# EAGLE design Mergen Telemetri + Ateşleme (EAGLE 9.6.2)
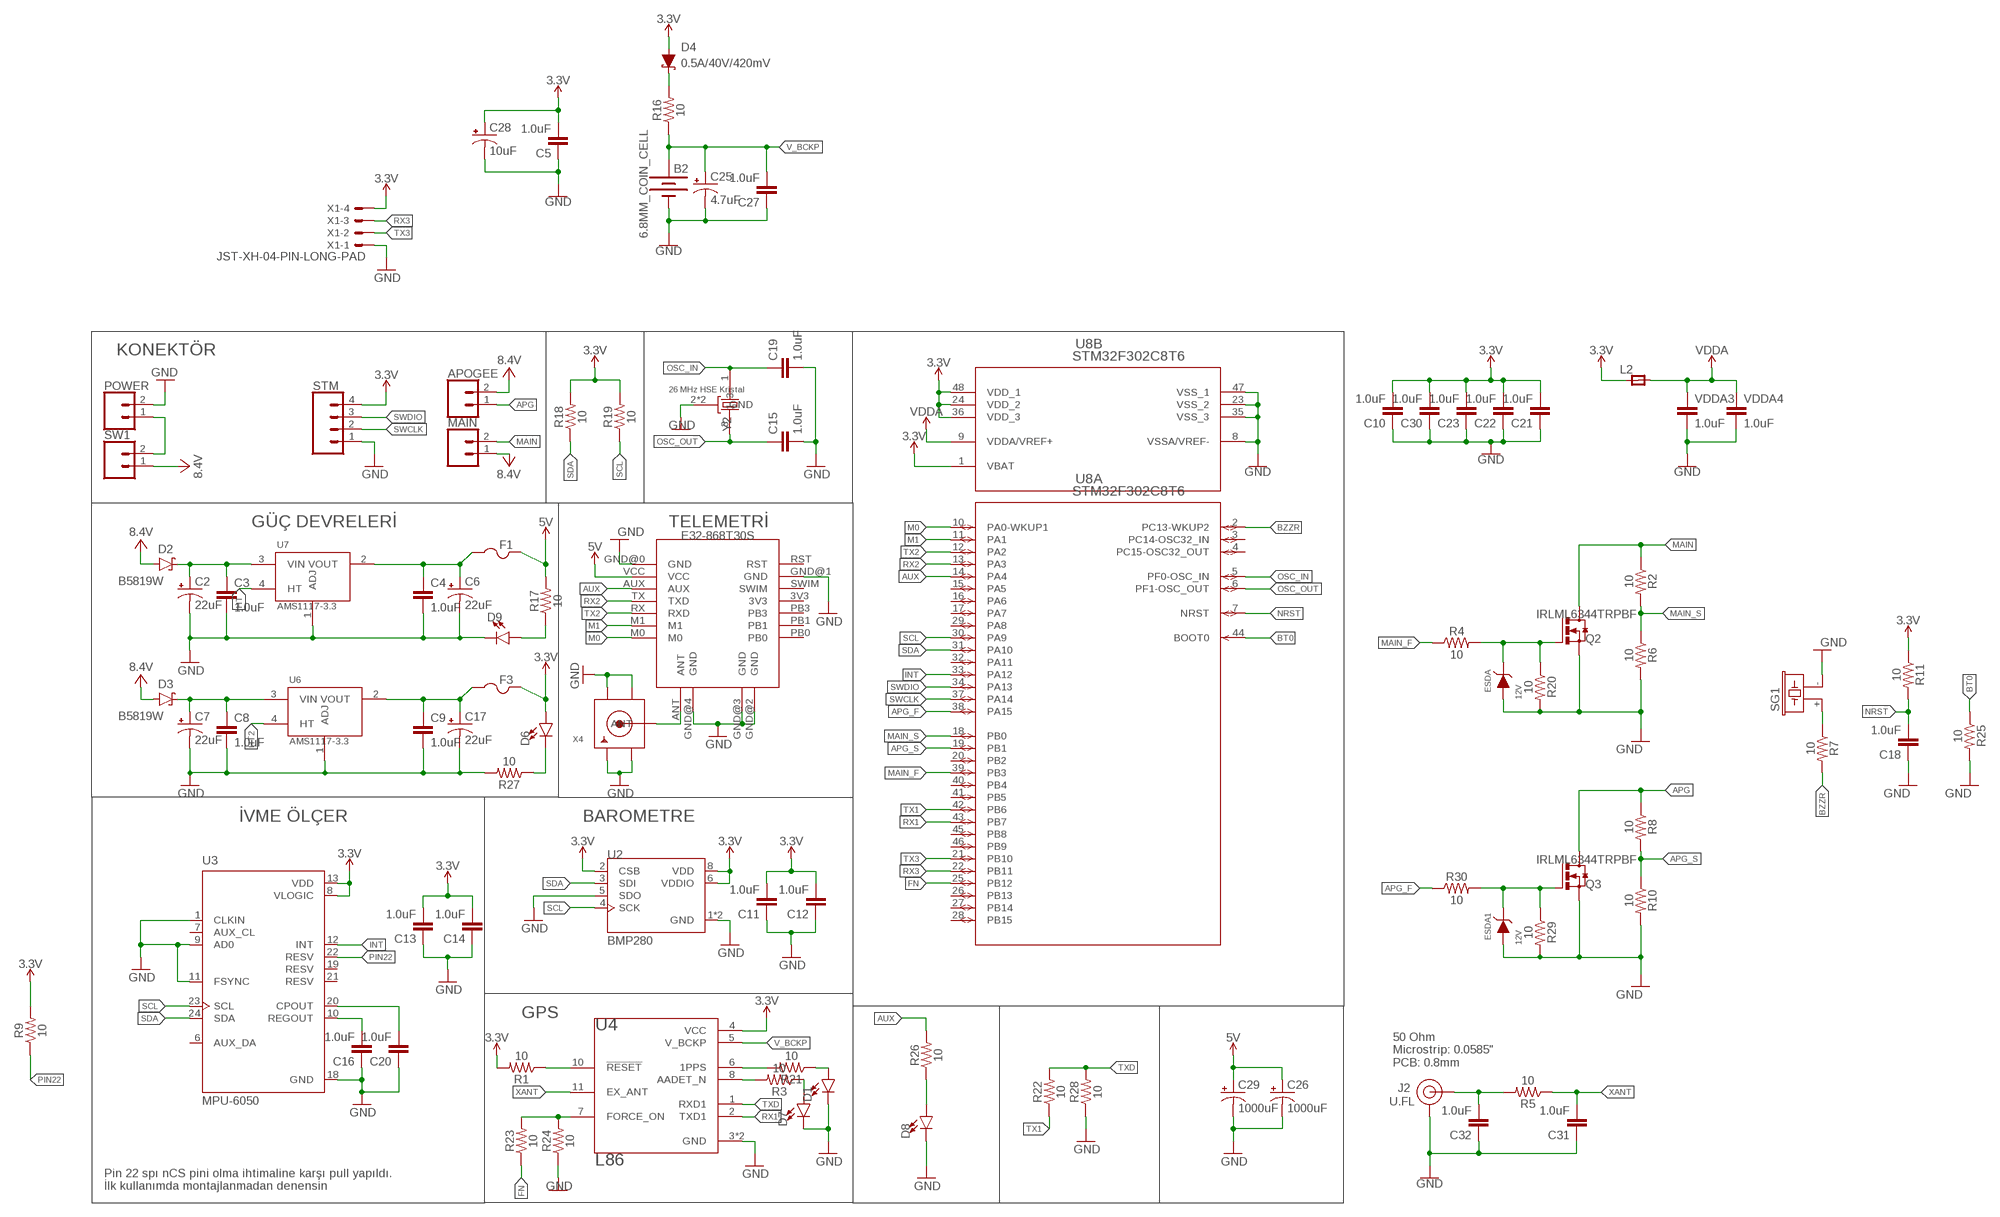
[diagram p0: schematic, sheet 1]

## Parts
APOGEE  CONN_023.5MM-NO_SILK  [SCREWTERMINAL-3.5MM-2-NS]
B2  6.8MM_COIN_CELL  BATTERY-6.8MM_SMD  [BATTCON-6.8MM]
C2  22uF  47UF-POLAR-EIA3528-10V-10%  [EIA3528]
C3  1.0uF  1.0UF-1206-50V-10%  [1206]
C4  1.0uF  1.0UF-1206-50V-10%  [1206]
C5  1.0uF  1.0UF-1206-50V-10%  [1206]
C6  22uF  47UF-POLAR-EIA3528-10V-10%  [EIA3528]
C7  22uF  47UF-POLAR-EIA3528-10V-10%  [EIA3528]
C8  1.0uF  1.0UF-1206-50V-10%  [1206]
C9  1.0uF  1.0UF-1206-50V-10%  [1206]
C10  1.0uF  1.0UF-1206-50V-10%  [1206]
C11  1.0uF  1.0UF-1206-50V-10%  [1206]
C12  1.0uF  1.0UF-1206-50V-10%  [1206]
C13  1.0uF  1.0UF-1206-50V-10%  [1206]
C14  1.0uF  1.0UF-1206-50V-10%  [1206]
C15  1.0uF  1.0UF-1206-50V-10%  [1206]
C16  1.0uF  1.0UF-1206-50V-10%  [1206]
C17  22uF  47UF-POLAR-EIA3528-10V-10%  [EIA3528]
C18  1.0uF  1.0UF-1206-50V-10%  [1206]
C19  1.0uF  1.0UF-1206-50V-10%  [1206]
C20  1.0uF  1.0UF-1206-50V-10%  [1206]
C21  1.0uF  1.0UF-1206-50V-10%  [1206]
C22  1.0uF  1.0UF-1206-50V-10%  [1206]
C23  1.0uF  1.0UF-1206-50V-10%  [1206]
C25  4.7uF  47UF-POLAR-EIA3528-10V-10%  [EIA3528]
C26  1000uF  CPOL-US150CLZ-1010  [150CLZ-1010]
C27  1.0uF  1.0UF-1206-50V-10%  [1206]
C28  10uF  47UF-POLAR-EIA3528-10V-10%  [EIA3528]
C29  1000uF  CPOL-US150CLZ-1010  [150CLZ-1010]
C30  1.0uF  1.0UF-1206-50V-10%  [1206]
C31  1.0uF  1.0UF-1206-50V-10%  [1206]
C32  1.0uF  1.0UF-1206-50V-10%  [1206]
D1  LED1206  [LED-1206]
D2  B5819W  SCHOTTKY_MBR0520LT1GDO-219  [SODFL3718X115]
D3  B5819W  SCHOTTKY_MBR0520LT1GDO-219  [SODFL3718X115]
D4  0.5A/40V/420mV  DIODE-SCHOTTKY-PMEG4005EJ  [SOD-323]
D6  LED1206  [LED-1206]
D7  LED1206  [LED-1206]
D8  LED1206  [LED-1206]
D9  LED1206  [LED-1206]
ESDA  12V  WE-TVSP_DO-214AC_400W_UNI_824500102  [WE-TVSP_DO-214AC_UNIDIRECTIONAL]
ESDA1  12V  WE-TVSP_DO-214AC_400W_UNI_824500102  [WE-TVSP_DO-214AC_UNIDIRECTIONAL]
F1  1A  PTCFUSE-1206  [R1206]
F3  0.75A  PTCFUSE-1206  [R1206]
J2  U.FL  U.FL2PIN  [U.FL]
L2  RC-MASTER-SMD_FB_1206MP  [RC-MASTER-SMD_L1206MP]
MAIN  CONN_023.5MM-NO_SILK  [SCREWTERMINAL-3.5MM-2-NS]
POWER  CONN_023.5MM-NO_SILK  [SCREWTERMINAL-3.5MM-2-NS]
Q2  IRLML6344TRPBF  [SOT23]
Q3  IRLML6344TRPBF  [SOT23]
R1  10  10OHM-1206-1/4W-1%  [1206]
R2  10  10OHM-1206-1/4W-1%  [1206]
R3  10  10OHM-1206-1/4W-1%  [1206]
R4  10  10OHM-1206-1/4W-1%  [1206]
R5  10  10OHM-1206-1/4W-1%  [1206]
R6  10  10OHM-1206-1/4W-1%  [1206]
R7  10  10OHM-1206-1/4W-1%  [1206]
R8  10  10OHM-1206-1/4W-1%  [1206]
R9  10  10OHM-1206-1/4W-1%  [1206]
R10  10  10OHM-1206-1/4W-1%  [1206]
R11  10  10OHM-1206-1/4W-1%  [1206]
R16  10  10OHM-1206-1/4W-1%  [1206]
R17  10  10OHM-1206-1/4W-1%  [1206]
R18  10  10OHM-1206-1/4W-1%  [1206]
R19  10  10OHM-1206-1/4W-1%  [1206]
R20  10  10OHM-1206-1/4W-1%  [1206]
R21  10  10OHM-1206-1/4W-1%  [1206]
R22  10  10OHM-1206-1/4W-1%  [1206]
R23  10  10OHM-1206-1/4W-1%  [1206]
R24  10  10OHM-1206-1/4W-1%  [1206]
R25  10  10OHM-1206-1/4W-1%  [1206]
R26  10  10OHM-1206-1/4W-1%  [1206]
R27  10  10OHM-1206-1/4W-1%  [1206]
R28  10  10OHM-1206-1/4W-1%  [1206]
R29  10  10OHM-1206-1/4W-1%  [1206]
R30  10  10OHM-1206-1/4W-1%  [1206]
SG1  F/CM12P  [F/CM12P]
STM  CONN_04  [1X04]
SW1  CONN_023.5MM-NO_SILK  [SCREWTERMINAL-3.5MM-2-NS]
U2  BMP280  [XDCR_BMP280]
U3  MPU-6050  [QFN50P400X400X95-24N]
U4  L86  [XCVR_L86]
U5  E32-868T30S  [E32-868T30S]
U6  AMS1117-3.3  [SOT229P700X180-4N]
U7  AMS1117-3.3  [SOT229P700X180-4N]
U8  STM32F302C8T6  [LQFP48-7X7MM]
VDDA3  1.0uF  1.0UF-1206-50V-10%  [1206]
VDDA4  1.0uF  1.0UF-1206-50V-10%  [1206]
X1  JST-XH-04-PIN-LONG-PAD  [JST-XH-04-PACKAGE-LONG-PAD]
X4  SMACONNECTOR  [SMA90_DIP]
Y2  ABM3B-26.000MHZ-10-1-U-T  [OSCCC500X320X110-4N]

## Nets
3.3V: C5.2 C10.2 C11.2 C12.2 C13.2 C14.2 C21.2 C22.2 C23.2 C28.A(+) C30.2 D4.A D6.A F3.2 L2.1 R1.2 R9.2 R11.1 R18.2 R19.2 STM.4 U2.2(CSB) U2.6(VDDIO) U2.8(VDD) U3.8(VLOGIC) U3.13(VDD) U4.4(VCC) U8.1(B:VBAT) U8.24(B:VDD_2) U8.36(B:VDD_3) U8.48(B:VDD_1) X1.4
5V: C26.+ C29.+ F1.2 R17.2 U5.VCC
APG: APOGEE.1 Q3.3(D) R8.1
APG_F: R30.1 U8.38(A:PA15)
APG_S: R8.2 R10.1 U8.19(A:PB1)
AUX: R26.2 U5.AUX U8.14(A:PA4)
BT0: R25.1 U8.44(A:BOOT0)
BZZR: R7.2 U8.2(A:PC13-WKUP2)
FN: R23.1 U8.25(A:PB12)
GND: B2.- C2.C(-) C3.2 C4.2 C5.1 C6.C(-) C7.C(-) C8.2 C9.2 C10.1 C11.1 C12.1 C13.1 C14.1 C15.2 C16.1 C17.C(-) C18.1 C19.2 C20.1 C21.1 C22.1 C23.1 C25.C(-) C26.- C27.1 C28.C(-) C29.- C30.1 C31.1 C32.1 D1.C D7.C D8.C D9.C ESDA1.2(A) ESDA.2(A) J2.1(GND) J2.2(GND) POWER.2 Q2.2(S) Q3.2(S) R6.2 R10.2 R20.2 R24.1 R25.2 R27.2 R28.1 R29.2 SG1.- STM.1 U2.1(GND) U2.5(SDO) U2.7(GND) U3.1(CLKIN) U3.9(AD0) U3.11(FSYNC) U3.18(GND) U4.3(GND) U4.12(GND) U5.GND@0(GND) U5.GND@1(GND) U5.GND@2(GND) U5.GND@3(GND) U5.GND@4(GND) U6.1(ADJ) U7.1(ADJ) U8.8(B:VSSA/VREF-) U8.23(B:VSS_2) U8.35(B:VSS_3) U8.47(B:VSS_1) VDDA3.2 VDDA4.2 X1.1 X4.GND1 X4.GND2 X4.GND3 X4.GND4 Y2.2(GND) Y2.4(GND)
HT: U7.4(HT)
HT2: U6.4(HT)
INT: U3.12(INT) U8.33(A:PA12)
M0: U5.M0 U8.10(A:PA0-WKUP1)
M1: U5.M1 U8.11(A:PA1)
MAIN: MAIN.2 Q2.3(D) R2.1
MAIN_F: R4.1 U8.39(A:PB3)
MAIN_S: R2.2 R6.1 U8.18(A:PB0)
N$1: C2.A(+) C3.1 D2.1(C) U7.3(VIN)
N$2: C7.A(+) C8.1 D3.1(C) U6.3(VIN)
N$3: R1.1 U4.10(!RESET)
N$4: C4.1 C6.A(+) F1.1 U7.2(VOUT)
N$5: C9.1 C17.A(+) F3.1 U6.2(VOUT)
N$6: ESDA1.1(C) Q3.1(G) R29.1 R30.2
N$7: U5.ANT X4.ANTENNA(ANT)
N$8: R7.1 SG1.+
N$9: POWER.1 SW1.2
N$10: R21.2 U4.6(1PPS)
N$11: D1.A R21.1
N$12: D4.C R16.2
N$13: ESDA.1(C) Q2.1(G) R4.2 R20.1
N$14: D9.A R17.1
N$15: D6.C R27.1
N$16: R3.2 U4.8(AADET_N)
N$17: D7.A R3.1
N$18: C16.2 U3.10(REGOUT)
N$19: C32.2 J2.FEED(SIGNAL) R5.2
N$20: R23.2 R24.2 U4.7(FORCE_ON)
N$21: D8.A R26.1
N$22: C20.2 U3.20(CPOUT)
NRST: C18.2 R11.2 U8.7(A:NRST)
OSC_IN: C19.1 U8.5(A:PF0-OSC_IN) Y2.1
OSC_OUT: C15.1 U8.6(A:PF1-OSC_OUT) Y2.3
PIN22: R9.1 U3.22(RESV)
RX1: U4.2(TXD1) U8.43(A:PB7)
RX2: U5.TX(TXD) U8.13(A:PA3)
RX3: U8.22(A:PB11) X1.3
SCL: R19.1 U2.4(SCK) U3.23(SCL) U8.30(A:PA9)
SDA: R18.1 U2.3(SDI) U3.24(SDA) U8.31(A:PA10)
SWCLK: STM.2 U8.37(A:PA14)
SWDIO: STM.3 U8.34(A:PA13)
TX1: R22.1 U8.42(A:PB6)
TX2: U5.RX(RXD) U8.12(A:PA2)
TX3: U8.21(A:PB10) X1.2
TXD: R22.2 R28.2 U4.1(RXD1)
V_BCKP: B2.+ C25.A(+) C27.2 R16.1 U4.5(V_BCKP)
VCC: APOGEE.2 D2.2(A) D3.2(A) MAIN.1 SW1.1 ; supply symbol labelled 8.4V
VDDA: L2.2 U8.9(B:VDDA/VREF+) VDDA3.1 VDDA4.1
XANT: C31.2 R5.1 U4.11(EX_ANT)
Unconnected: U3.6(AUX_DA) U3.7(AUX_CL) U3.19(RESV) U3.21(RESV) U5.3V3 U5.PB0 U5.PB1 U5.PB3 U5.RST U5.SWIM U8.3(A:PC14-OSC32_IN) U8.4(A:PC15-OSC32_OUT) U8.15(A:PA5) U8.16(A:PA6) U8.17(A:PA7) U8.20(A:PB2) U8.26(A:PB13) U8.27(A:PB14) U8.28(A:PB15) U8.29(A:PA8) U8.32(A:PA11) U8.40(A:PB4) U8.41(A:PB5) U8.45(A:PB8) U8.46(A:PB9)

## Notes on the sheet
- KONEKTÖR
- 26 MHz HSE Kristal
- GÜÇ DEVRELERİ | TELEMETRİ
- İVME ÖLÇER | BAROMETRE
- GPS
- 50 Ohm 
  Microstrip: 0.0585"
  PCB: 0.8mm
- Pin 22 spı nCS pini olma ihtimaline karşı pull yapıldı. 
  İlk kullanımda montajlanmadan denensin

## Library data of the parts
APOGEE MAIN POWER SW1 = SparkFun-Connectors:CONN_02: Multi connection point. Often used as Generic Header-pin footprint for 0.1 inch spaced/style header connections On any of the 0.1 inch spaced packages, you can populate with these: Break Away Headers - Straight <https://www.sparkfun.com/products/116> (PRT-00116) Break Away Male Headers - Right Angle <https://www.sparkfun.com/products/553> (PRT-00553) Female Headers <https://www.sparkfun.com/products/115> (PRT-00115) Break Away Headers - Machine Pin <https://www.sparkfun.com/products/117> (PRT-00117) Break Away Female Headers - Swiss Machine Pin <https://www.sparkfun.com/products/743> (PRT-00743) For SCREWTERMINALS and SPRING TERMINALS visit here: Screw Terimnals on SparkFun.com <https://www.sparkfun.com/search/results?term=Screw+Terminals> (5mm/3.5mm/2.54mm spacing) This device is also useful as a general connection point to wire up your design to another part of your project. Our various solder wires solder well into these plated through hole pads. Hook-Up Wire - Assortment (Stranded, 22 AWG) <https://www.sparkfun.com/products/11375> (PRT-11375) Hook-Up Wire - Assortment (Solid Core, 22 AWG) <https://www.sparkfun.com/products/11367> (PRT-11367) View the entire wire category on our website here <https://www.sparkfun.com/categories/141> Special notes: Molex polarized connector foot print use with: PRT-08233 with associated crimp pins and housings. 2.54_SCREWTERM for use with PRT-10571. 3.5mm Screw Terminal footprints for PRT-08084 5mm Screw Terminal footprints for use with PRT-08432; PROD_ID: CONN-08399
B2 = SparkFun-Batteries:BATTERY: Battery - Single Cell A variety of battery chemistries, sizes, and footprints. Device List: 20MM_PTH - Coin Cell Battery Holder - 20mm (PTH) <https://www.sparkfun.com/products/783> 6.8MM_PTH - Coin Cell Battery Holder - 6.8MM(SMD) <https://www.digikey.com/product-detail/en/seiko-instruments/MS621FE-FL11E/728-1057-ND/1889208?WT.srch=1&gclid=CNOQ5a6LzdQCFZS2wAodXCkE0g> 12MM_SMD - Coin Cell Battery Holder - 12mm (SMD) <https://www.sparkfun.com/products/10592> 12MM_PTH - Coin Cell Battery Holder - 12mm (PTH) <https://www.sparkfun.com/products/7948> 20MM_SMD - 20mm Coin Cell Battery Holder (SMD) (2 legs) Used on the Big Time Watch Kit <https://www.sparkfun.com/products/11734> 20MM_SMD_4LEGS - Coin Cell Battery Holder - 20mm (SMD) <https://www.sparkfun.com/products/11892> 20MM_SMD_4LEGS_OVERPASTE - Coin Cell Battery Holder - 20mm (SMD) <https://www.sparkfun.com/products/11892> (Over-paste on the legs) 24.5MM_PTH - Coin Cell Battery Holder - 24.5mm (PTH) <https://www.sparkfun.com/products/8863> 9V - 9V Battery Holder - PC Mount Used on the SparkFun SparkPunk Sound Kit <https://www.sparkfun.com/products/11177> and SparkFun SparkPunk Sequencer Kit <https://www.sparkfun.com/products/12707> 18650 - Battery Holder - 18650 (PTH) <https://www.sparkfun.com/products/13113> AA - Battery Holder - 1xAA (PTH) <https://www.sparkfun.com/products/7949> AAA - Battery Holder - 1xAAA (PTH) <https://www.sparkfun.com/products/12718> AA_KIT - Battery Holder - 1xAA (PTH) <https://www.sparkfun.com/products/7949> Special kit package - pads only have exposed copper on one side of the board. AAA_KIT - Battery Holder - 1xAAA (PTH) <https://www.sparkfun.com/products/12718> Special kit package - pads only have exposed copper on one side of the board.; PROD_ID: BATT-13734
C2 C6 C7 C17 C25 C28 = SparkFun-Capacitors:47UF-POLAR: 47µF polarized capacitors A capacitor is a passive two-terminal electrical component used to store electrical energy temporarily in an electric field.; PROD_ID: CAP-08310; VALUE: 47uF
C3-C5 C8-C16 C18-C23 C27 C30-C32 VDDA3 VDDA4 = SparkFun-Capacitors:1.0UF: 1µF ceramic capacitors A capacitor is a passive two-terminal electrical component used to store electrical energy temporarily in an electric field.; PROD_ID: CAP-09822
C26 C29 = adafruit:CPOL-US: POLARIZED CAPACITOR, American symbol
D1 D6-D9 = SparkFun-LED:LED: LED (Generic) Standard schematic elements and footprints for 5mm, 3mm, 1206, and 0603 sized LEDs. Generic LEDs with no color specified.
D2 D3 = Diode:SCHOTTKY_: Schottky Diode - Popular parts; CATEGORY: Diode; DESCRIPTION: DIODE SCHOTTKY 20V 500MA SOD123; MANUFACTURER: ON Semiconductor; MPN: MBR0520LT1G; SUB-CATEGORY: Schottky; VALUE: MBR0520LT1G
D4 = SparkFun-DiscreteSemi:DIODE-SCHOTTKY: Schottky diode A Schottky diode is a semiconductor diode which has a low forward voltage drop and a very fast switching action.; PROD_ID: DIO-10955
ESDA ESDA1 = Wurth_EMC Components_WE-TVSP:WE-TVSP_DO-214AC_400W_UNI: WE-TVSP Power TVS Diode Characteristics Low Profile Package Glass passivated Juction Excellent clamping capability Fast response time MSL Level 1, per J-STD-020 Classification of the plastic case: UL 94 V-0 Safety certification UL 497B, E478010 Identical design: - DO-214AC = SMAJ - DO-214AA = SMBJ - DO-214AB = SMCJ/SMDJ Applications Ideal to protect the I/O Interfaces, Bus Voltage and other circuits of sensetive electronic equipment against voltage transiensts <https://www.we-online.com/catalog/media/o55793v209%20WE-TVSP_600W-3000W_D0214AA_4C.jpg> Details see: https://www.we-online.com/catalog/en/WE-TVSP/ Updated by Ella Wu 2020-07-20 2020 (C) Würth Elektronik; DATASHEET-URL: https://www.we-online.com/catalog/datasheet/824500102.pdf; IPEAK: 2.5A; MOUNT: SMT; PART-NUMBER: 824500102; PDISS: 400W; VALUE: 100V; VBR: 117V; VCLAMP: 162V
F1 F3 = adafruit:PTCFUSE: PTC fuses, resettable thermistors
J2 = SparkFun-Connectors:U.FL2PIN: SMD Antenna Connector - U.FL 2mm height, 3.0mm x 3.0mm receptacle size. SparkFun Products: SparkFun WiFi Shield - ESP8266 <https://www.sparkfun.com/products/13287> SparkFun ESP8266 Thing <https://www.sparkfun.com/products/13231> SparkFun MiniGen - Pro Mini Signal Generator Shield <https://www.sparkfun.com/products/11420>; PROD_ID: CONN-09193; SF_ID: WRL-09144
L2 = 52101-101-REV-A_v16:RC-MASTER-SMD_FB_: FERRITE BEAD
Q2 Q3 = IRLML6344TRPBF (1):IRLML6344TRPBF: Transistor NMOS 30V 6.3A, 29mOhm@4.5V; AVAILABILITY: Unavailable; DESCRIPTION: RoHS Compliant | Low RDS(on) | Industry-Standard Pinout | Compatible with Existing Surface Mount Techniques | Qualified MSL1 | SOT-23 Footprint; MF: Infineon; MP: IRLML6344TRPBF; PACKAGE: SOT-23-3 International Rectifier; PRICE: None
R1-R11 R16-R30 = SparkFun-Resistors:10OHM: 10Ω resistor A resistor is a passive two-terminal electrical component that implements electrical resistance as a circuit element. Resistors act to reduce current flow, and, at the same time, act to lower voltage levels within circuits. - Wikipedia; PROD_ID: RES-08705
SG1 = buzzer:F/CM12P: BUZZER Source: Buerklin; OC_FARNELL: unknown; OC_NEWARK: unknown
STM = SparkFun-Connectors:CONN_04: Multi connection point. Often used as Generic Header-pin footprint for 0.1 inch spaced/style header connections On any of the 0.1 inch spaced packages, you can populate with these: Break Away Headers - Straight <https://www.sparkfun.com/products/116> (PRT-00116) Break Away Male Headers - Right Angle <https://www.sparkfun.com/products/553> (PRT-00553) Female Headers <https://www.sparkfun.com/products/115> (PRT-00115) Break Away Headers - Machine Pin <https://www.sparkfun.com/products/117> (PRT-00117) Break Away Female Headers - Swiss Machine Pin <https://www.sparkfun.com/products/743> (PRT-00743) For SCREWTERMINALS and SPRING TERMINALS visit here: Screw Terimnals on SparkFun.com <https://www.sparkfun.com/search/results?term=Screw+Terminals> (5mm/3.5mm/2.54mm spacing) This device is also useful as a general connection point to wire up your design to another part of your project. Our various solder wires solder well into these plated through hole pads. Hook-Up Wire - Assortment (Stranded, 22 AWG) <https://www.sparkfun.com/products/11375> (PRT-11375) Hook-Up Wire - Assortment (Solid Core, 22 AWG) <https://www.sparkfun.com/products/11367> (PRT-11367) View the entire wire category on our website here <https://www.sparkfun.com/categories/141> Special notes: Molex polarized connector foot print use with SKU : PRT-08231 with associated crimp pins and housings. 1MM SMD Version SKU: PRT-10208; PROD_ID: CONN-09696
U2 = BMP280:BMP280: BMP280 Absolute Barometric Pressure Sensor for Battery Powered Devices 2 x 2.5mm Check prices <https://pricing.snapeda.com/parts/BMP280/Bosch/view-part?ref=eda>; AVAILABILITY: Warning; DESCRIPTION: Pressure Sensor 4.35PSI ~ 15.95PSI (30kPa ~ 110kPa) Absolute 16b 8-SMD; MF: Bosch; MP: BMP280; PACKAGE: SMD-8 Bosch Sensortec; PRICE: None; PURCHASE-URL: https://pricing.snapeda.com/search/part/BMP280/?ref=eda
U3 = MPU-6050:MPU-6050: MPU-6050 Six-Axis (Gyro + Accelerometer) MEMS MotionTracking™ Devices Check prices <https://pricing.snapeda.com/parts/MPU-6050/TDK%20InvenSense/view-part?ref=eda>; AVAILABILITY: Warning; DESCRIPTION: Accelerometer, Gyroscope, 6 Axis Sensor I²C Output; MF: TDK InvenSense; MP: MPU-6050; PACKAGE: QFN-24 InvenSense; PRICE: None; PURCHASE-URL: https://pricing.snapeda.com/search/part/MPU-6050/?ref=eda
U4 = L86:L86: L86 is an ultra-compact GNSS POT (Patch on Top) module with an embedded 18.4mm × 18.4mm × 4.0mm patch antenna and utilizes the MediaTek new generation GNSS chipset MT3333 that achieves the perfect performance; AVAILABILITY: Unavailable; DESCRIPTION: L86 is an ultra-compact GNSS POT (Patch on Top) module with an embedded 18.4mm × 18.4mm × 4.0mm patch antenna and utilizes the MediaTek new generation GNSS chipset MT3333 that achieves the perfect performance; MF: Quectel; MP: L86; PACKAGE: PowerSFN-8 Quectel; PRICE: None
U5 = E32-868T30S:E32-868T30S: E BYTE E32-868T30S
U6 U7 = AMS1117-3.3:AMS1117-3.3: Sot223/Pkg 1-Amp 3.3-Volt Low Drop Out Voltage Regulatator; AVAILABILITY: Unavailable; DESCRIPTION: Sot223/Pkg 1-Amp 3.3-Volt Low Drop Out Voltage Regulatator; MF: Advanced Monolithic Systems; MP: AMS1117-3.3; PACKAGE: SOT-89 ams; PRICE: None
U8 = STM32F302C8T6:STM32F302C8T6; BUILT_BY: EMA_UL_Team; COPYRIGHT: Copyright (C) 2018 Accelerated Designs. All rights reserved; MANUFACTURER_PART_NUMBER: STM32F302C8T6; SOURCELIBRARY: Updates_to_database_2020-10-19; VENDOR: STMicroelectronics
X1 = Rembrandt Electronics - JST XH Connectors v1-0:JST-XH-04-PIN: JST XH Connector 2 Pin Wire to board connector. Pitch: 2,54 mm, (0.100") Number of pins: 4 Created by Rembrandt Electronics www.rembrandtelectronics.com
X4 = adafruit:SMACONNECTOR: SMA Connector 90° DIP SMA Connector, 50 Ohm (4UConnector: 07259)
Y2 = ABM3B-26.000MHZ-10-1-U-T:ABM3B-26.000MHZ-10-1-U-T: Ceramic SMD Crystal Check prices <https://pricing.snapeda.com/parts/ABM3B-26.000MHZ-10-1-U-T/Abracon/view-part?ref=eda>; AVAILABILITY: Good; DESCRIPTION: 26MHz ±10ppm Crystal 10pF 50 Ohms 4-SMD, No Lead; MF: Abracon; MP: ABM3B-26.000MHZ-10-1-U-T; PACKAGE: SMD-4 Abracon LLC; PRICE: None; PURCHASE-URL: https://pricing.snapeda.com/search/part/ABM3B-26.000MHZ-10-1-U-T/?ref=eda

## Net classes
1 Power: width 0.305 mm

## Board
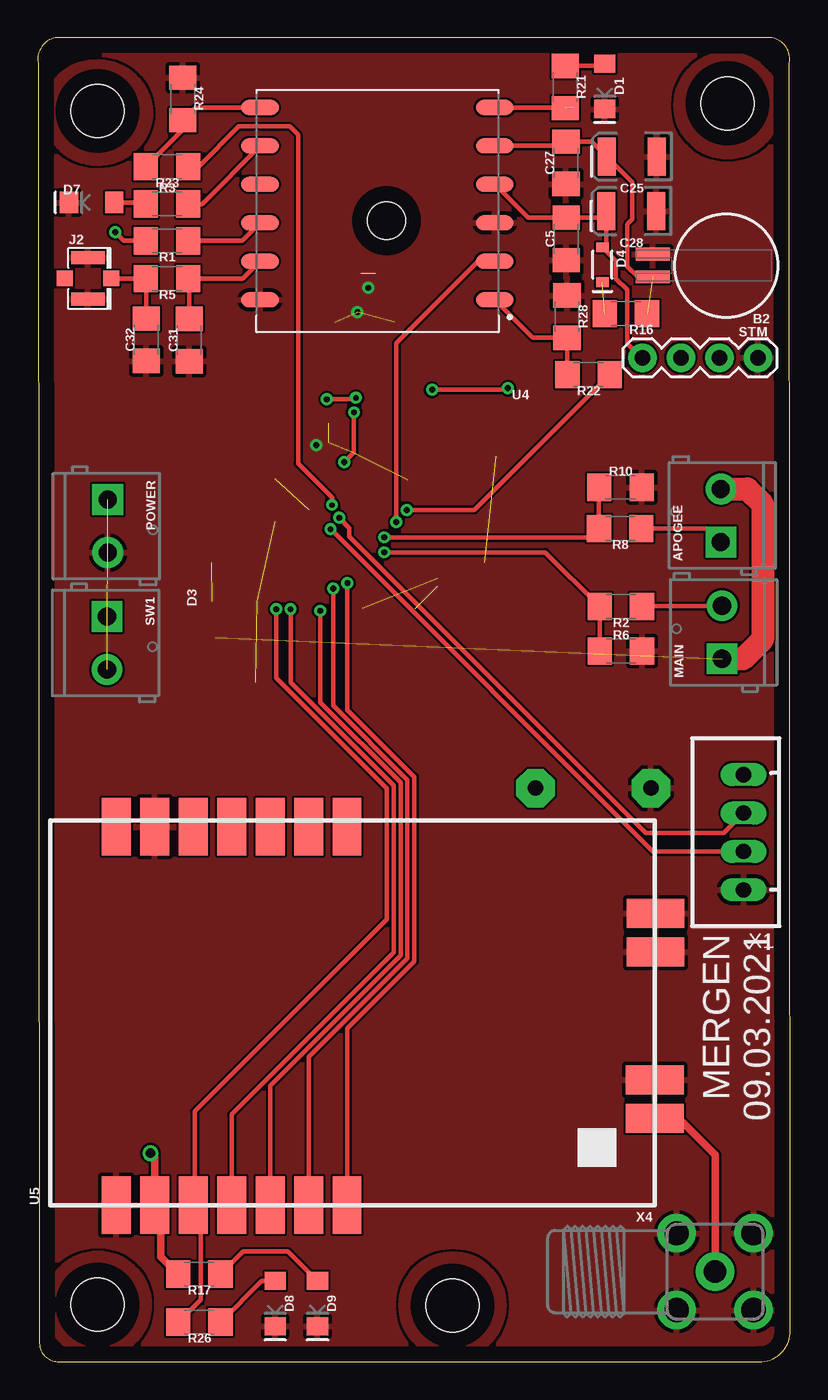
[diagram p1: board, top side]
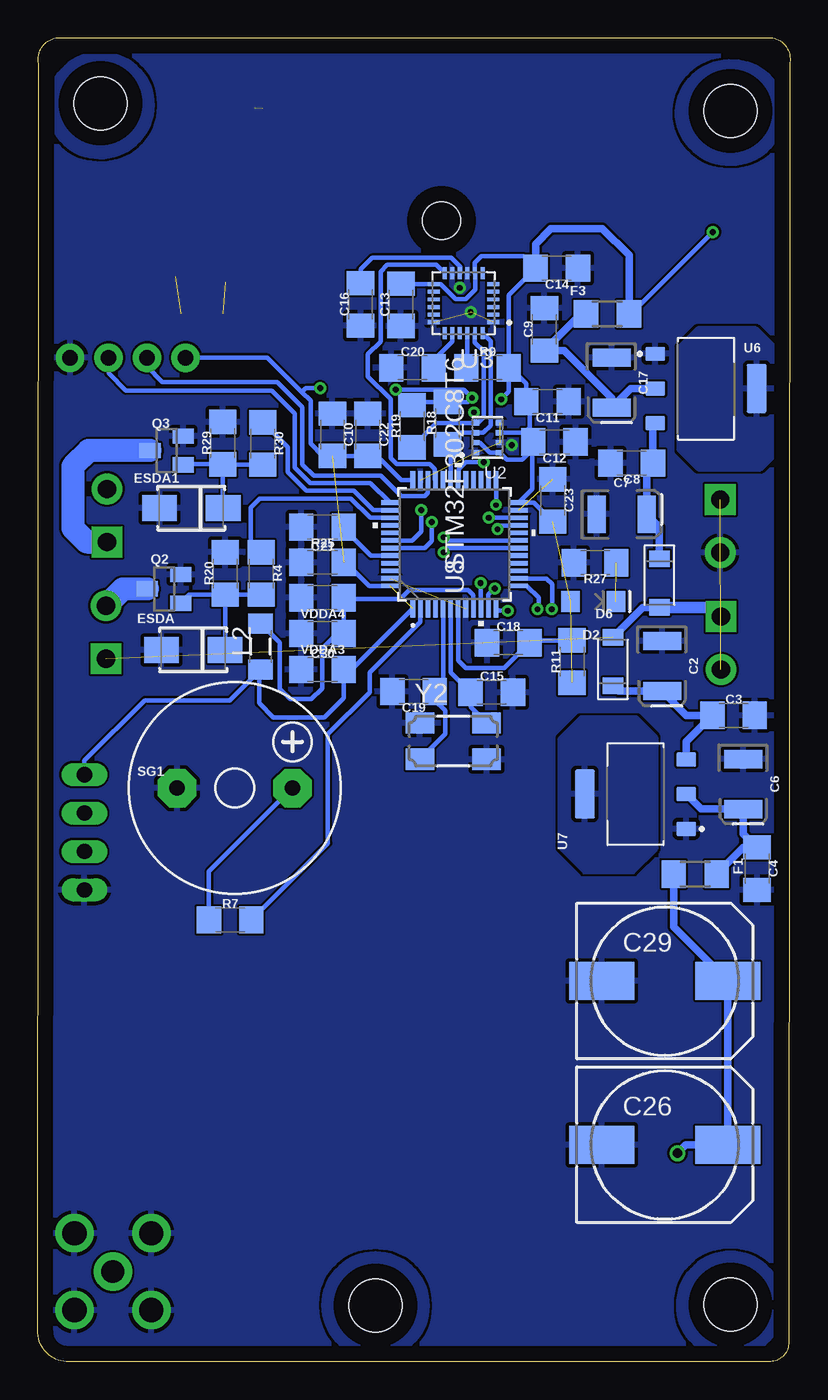
[diagram p2: board, bottom side, seen from below]

Size 49.68 x 87.45 mm. Coordinates in mm from the lower left corner, seen from the top.
Outline: 0.02,85.81 0.1,1.3 arc90 1.3,0 47.62,0 arc90 49.68,1.88 49.63,85.75 arc90 48.49,87.45 1.16,87.45 arc90 0.02,85.81
Copper layers (1*16): Top 0.035mm / dielectric 1.5mm / Bottom 0.035mm
Design rules "default": minimum track width 6mil, minimum drill 0.35mm, track to track 6mil, track to pad 6mil, pad to pad 6mil, via to via 6mil, smd to smd 6mil, copper to edge 40mil, drill to drill 6mil, minimum pad ring 10mil, minimum via ring 8mil, stop-mask expansion 4mil, vias tented up to drill 0mil, thermal gap 10mil
Holes 3.5 mm at 3.93,82.63 45.54,83.13 27.38,3.71 3.93,3.76
Holes 2.5 mm at 23.02,75.38

### Footprints (pad centres in the part's own frame; a part is rotated, then mirrored left to right if it is on the bottom)
SCREWTERMINAL-3.5MM-2-NS = drill 1.2 pad 2.032 square: 1 0,0 | drill 1.2 pad 2.032: 2 3.5,0
BATTCON-6.8MM = smd 2.25 x 0.85: + 4.87,0.75; - 4.87,-0.75
EIA3528 = smd 1.2 x 2.5: A 1.65,0; C -1.65,0
1206 = smd 1.6 x 1.8: 1 -1.4,0; 2 1.4,0
150CLZ-1010 = smd 4.3 x 2.5: + 4.15,0; - -4.15,0
LED-1206 = smd 1.2 x 1.4: A -1.5,0; C 1.5,0
SODFL3718X115 = smd 1.115 x 1.361: 1 -1.6,0; 2 1.6,0
SOD-323 = smd 0.63 x 0.83: A 1.15,0; C -1.15,0
WE-TVSP_DO-214AC_UNIDIRECTIONAL = smd 2.3 x 1.7: 1 -2.1,0; 2 2.1,0
R1206 = smd 1.6 x 1.803: 1 -1.422,0; 2 1.422,0
U.FL = smd 2.2 x 0.85: 1 0,1.375; 2 0,-1.375 | smd 1.05 x 1: FEED 1.525,0; NC -1.525,0
RC-MASTER-SMD_L1206MP = smd 1.3 x 1.6: 1 -1.524,0; 2 1.524,0
SOT23 = smd 1 x 1.4: 1 -0.95,-1.1; 2 0.95,-1.1; 3 0,1.1
F/CM12P = drill 1.016 pad 2.54 octagon: + 3.81,0; - -3.81,0
1X04 = drill 1.016 pad 1.88: 1 0,0; 2 2.54,0; 3 5.08,0; 4 7.62,0
XDCR_BMP280 = smd 0.5 x 0.35: 1 0.8,0.975; 2 0.8,0.325; 3 0.8,-0.325; 4 0.8,-0.975; 5 -0.8,-0.975; 6 -0.8,-0.325; 7 -0.8,0.325; 8 -0.8,0.975
QFN50P400X400X95-24N = smd 0.79 x 0.26: 1 -1.97,1.25; 2 -1.97,0.75; 3 -1.97,0.25; 4 -1.97,-0.25; 5 -1.97,-0.75; 6 -1.97,-1.25; 13 1.97,-1.25; 14 1.97,-0.75; 15 1.97,-0.25; 16 1.97,0.25; 17 1.97,0.75; 18 1.97,1.25 | smd 0.26 x 0.79: 7 -1.25,-1.97; 8 -0.75,-1.97; 9 -0.25,-1.97; 10 0.25,-1.97; 11 0.75,-1.97; 12 1.25,-1.97; 19 1.25,1.97; 20 0.75,1.97; 21 0.25,1.97; 22 -0.25,1.97; 23 -0.75,1.97; 24 -1.25,1.97
XCVR_L86 = smd 2.5 x 1: 1 -7.75,6.35; 2 -7.75,3.81; 3 -7.75,1.27; 4 -7.75,-1.27; 5 -7.75,-3.81; 6 -7.75,-6.35; 7 7.75,-6.35; 8 7.75,-3.81; 9 7.75,-1.27; 10 7.75,1.27; 11 7.75,3.81; 12 7.75,6.35
E32-868T30S = smd 3.81 x 1.905: 3V3 12.3,5.08; AUX -12.7,7.62; GND@0 -12.7,12.7; GND@1 12.3,10.16; M0 -12.7,-2.54; M1 -12.7,0; PB0 12.3,-2.54; PB1 12.3,0; PB3 12.3,2.54; RST 12.3,12.7; RX -12.7,2.54; SWIM 12.3,7.62; TX -12.7,5.08; VCC -12.7,10.16 | smd 1.905 x 3.81: ANT -6.97,-22.86; GND@2 6.57,-22.91; GND@3 4.03,-22.91; GND@4 -4.43,-22.86
SOT229P700X180-4N = smd 0.93 x 1.31: 1 -2.29,-3.345; 2 0,-3.345; 3 2.29,-3.345 | smd 3.24 x 1.31: 4 0,3.345
LQFP48-7X7MM = smd 1.194 x 0.305: 1 -4.25,2.75; 2 -4.25,2.25; 3 -4.25,1.75; 4 -4.25,1.25; 5 -4.25,0.75; 6 -4.25,0.25; 7 -4.25,-0.25; 8 -4.25,-0.75; 9 -4.25,-1.25; 10 -4.25,-1.75; 11 -4.25,-2.25; 12 -4.25,-2.75; 25 4.25,-2.75; 26 4.25,-2.25; 27 4.25,-1.75; 28 4.25,-1.25; 29 4.25,-0.75; 30 4.25,-0.25; 31 4.25,0.25; 32 4.25,0.75; 33 4.25,1.25; 34 4.25,1.75; 35 4.25,2.25; 36 4.25,2.75 | smd 0.305 x 1.194: 13 -2.75,-4.25; 14 -2.25,-4.25; 15 -1.75,-4.25; 16 -1.25,-4.25; 17 -0.75,-4.25; 18 -0.25,-4.25; 19 0.25,-4.25; 20 0.75,-4.25; 21 1.25,-4.25; 22 1.75,-4.25; 23 2.25,-4.25; 24 2.75,-4.25; 37 2.75,4.25; 38 2.25,4.25; 39 1.75,4.25; 40 1.25,4.25; 41 0.75,4.25; 42 0.25,4.25; 43 -0.25,4.25; 44 -0.75,4.25; 45 -1.25,4.25; 46 -1.75,4.25; 47 -2.25,4.25; 48 -2.75,4.25
JST-XH-04-PACKAGE-LONG-PAD = drill 1.016 long: 1 -3.81,0; 2 -1.27,0; 3 1.27,0; 4 3.81,0
SMA90_DIP = drill 1.5 pad 2.54: ANTENNA 0,0 | drill 1.6 pad 2.54: GND1 -2.54,2.54; GND2 2.54,2.54; GND3 -2.54,-2.54; GND4 2.54,-2.54
OSCCC500X320X110-4N = smd 1.9 x 1.4: 1 -2.2,-1.2; 2 2.2,-1.2; 3 2.2,1.2; 4 -2.2,1.2

### Placement (x,y rotation side)
APOGEE  45.11,54.15 90 top
B2  45.46,72.42 180 top
C2  8.46,45.95 270 bottom
C3  3.73,42.7 0 bottom
C4  2.18,32.56 270 bottom
C5  34.9,74.17 90 top
C6  3.1,38.15 270 bottom
C7  11.12,55.98 0 bottom
C8  10.46,59.36 180 bottom
C9  16.23,68.2 90 bottom
C10  30.22,61.24 270 bottom
C11  16.02,63.42 180 bottom
C12  15.57,60.76 180 bottom
C13  25.7,69.82 90 bottom
C14  15.41,72.24 180 bottom
C15  19.71,44.22 0 bottom
C16  28.37,69.85 90 bottom
C17  11.78,64.67 270 bottom
C18  18.62,47.5 0 bottom
C19  24.86,44.27 180 bottom
C20  24.94,65.66 0 bottom
C21  30.88,52.81 0 bottom
C22  27.89,61.24 270 bottom
C23  15.67,56.9 270 bottom
C25  39.21,79.6 180 top
C26  8.28,14.33 0 bottom
C27  34.87,79.2 90 top
C28  39.19,76 180 top
C29  8.28,25.15 0 bottom
C30  30.88,45.72 0 bottom
C31  10,67.49 90 top
C32  7.16,67.51 90 top
D1  37.44,84.25 270 top
D2  11.71,46.25 90 bottom
D3  8.63,51.44 270 bottom
D4  37.28,72.47 90 top
D6  13,50.22 0 bottom
D7  3.55,76.58 180 top
D8  15.67,3.84 270 top
D9  18.46,3.84 270 top
ESDA  39.42,47.02 180 bottom
ESDA1  39.54,56.39 180 bottom
F1  6.27,32.21 180 bottom
F3  12.06,69.22 0 bottom
J2  3.31,71.56 0 top
L2  34.97,47.24 90 bottom
MAIN  45.18,46.43 90 top
POWER  4.62,56.95 270 top
Q2  41.35,51.05 90 bottom
Q3  41.17,60.2 90 bottom
R1  8.53,74.04 180 top
R2  38.5,49.89 180 top
R3  8.53,76.48 0 top
R4  34.92,52.07 270 bottom
R5  8.53,71.55 180 top
R6  38.5,46.94 0 top
R7  36.98,29.18 0 bottom
R8  38.45,55.04 180 top
R9  19.99,65.66 0 bottom
R10  38.48,57.76 0 top
R11  14.4,46.25 90 bottom
R16  38.83,69.24 180 top
R17  10.67,5.79 180 top
R18  22.63,62 90 bottom
R19  24.97,61.8 90 bottom
R20  37.31,52.07 90 bottom
R21  34.82,84.2 270 top
R22  36.37,65.2 180 top
R23  8.53,78.94 180 top
R24  9.57,83.41 270 top
R25  30.88,55.14 180 bottom
R26  10.67,2.62 180 top
R27  12.87,52.78 180 bottom
R28  34.95,69.04 270 top
R29  37.46,60.68 90 bottom
R30  34.82,60.66 270 bottom
SG1  36.67,37.9 0 bottom
STM  47.55,66.32 180 top
SW1  4.57,49.23 270 top
U2  19.99,61.04 180 bottom
U3  21.56,69.93 180 bottom
U4  22.43,76.5 180 top
U5  17.88,23.04 90 top
U6  5.56,64.29 270 bottom
U7  10.21,37.49 90 bottom
U8  22.17,54 90 bottom
VDDA3  30.88,48.11 180 bottom
VDDA4  30.88,50.47 180 bottom
X1  46.61,34.98 90 top
X4  44.73,5.94 90 top
Y2  22.25,41 0 bottom

### Tracks (layer width: path | path; a pad name or v marks a point on that pad's centre or on a via)
3.3V  (via drill 0.38)  (4 unrouted)
  Top 0.305: STM.4 39.33,66.92 39.26,66.92 38.91,67.26 38.91,70.82 38.17,71.55 38.17,72.73 D4.A 37.54,73.87 C28.A 37.11,75.57 C5.2 32.38,75.57 U4.4 | R1.2 5.69,74.04 v5.1,74.63 | v21,63.68 20.9,63.58 v19.08,63.58 | v26.04,64.21 30.94,64.21 v31.04,64.31
  Bottom 0.305: U8.1 28.95,45.72 C30.2 29.48,43.84 30.76,42.57 34.13,42.57 35.07,43.51 35.07,45.62 L2.1 37,43.69 42.62,43.69 46.61,39.7 X1.4 | U8.48 27.8,51.25 29.36,52.81 C21.2 | C13.2 25.65,71.18 U3.13 23.07,71.18 22.08,70.19 21.43,70.19 20.8,70.82 20.8,71.89 U3.8 20.81,72.61 20.39,73.03 17.6,73.03 C14.2 18.59,70.47 18.59,65.76 | 18.59,65.76 R9.2 18.59,64.07 v19.08,63.58 | R19.2 24.76,63.4 R18.2 21.28,63.4 v21,63.68 21.54,64.21 v26.04,64.21 | C23.2 16.92,56.75 U8.24 17.03,57.64 17.03,60.69 C12.2 | 17.42,61.47 17.42,61.21 C12.2 | 18.59,65.76 17.42,64.6 C11.2 17.2,63.2 17.2,61.7 17.42,61.47 | U8.36 25.69,58.25 27.28,59.84 C22.2 C10.2 30.85,59.84 31.67,60.66 31.67,63.47 32.25,64.06 | STM.4 34.52,66.32 32.25,64.06 | U2.6 19.16,61.39 17.51,61.39 17.42,61.47 | C12.2 16.97,60.33 17.69,59.6 18.73,59.6 U2.8 19.85,60.06 20.5,60.71 U2.2 | v5.1,74.63 10.51,69.22 F3.2 | v31.04,64.31 32,64.31 32.25,64.06
  Bottom 0.508: F3.2 10.64,73.1 12.39,74.85 15.8,74.85 16.81,73.83 C14.2
5V  (via drill 0.64)
  Top 0.508: v7.44,13.77 7.72,13.49 U5.VCC 8.12,9.93 8.12,6.93 R17.2
  Bottom 0.508: F1.2 7.69,28.71 C29.+ C26.+ 6.88,14.33 v7.44,13.77
APG
  Top 0.305: R8.1 44.22,55.04 APOGEE.1
  Bottom 1.524: Q3.3 46.33,60.2 47.37,59.16 47.37,55.07 46.45,54.15 APOGEE.1
APG_F
  Bottom 0.305: U8.38 27.55,56.25 28.83,57.54 31.94,57.54 33.17,58.76 33.17,60.4 R30.1
APG_S  (via drill 0.38)
  Top 0.305: R8.2 37.05,55.19 | 37.05,55.19 37.05,57.73 R10.1 | v22.88,54.46 36.32,54.46 37.05,55.19
  Bottom 0.305: U8.19 22.67,54.25 v22.88,54.46
AUX  (via drill 0.38)
  Top 0.305: U5.AUX 10.36,10.24 | R26.2 10.74,4.09 10.74,9.86 10.47,10.12 10.36,10.24 | v15.74,49.71 15.74,45.16 23.03,37.87 23.03,29.21 10.36,16.54 10.36,10.24
  Bottom 0.305: U8.14 16.11,51.75 15.72,51.36 15.72,49.73 v15.74,49.71
BT0
  Bottom 0.305: U8.44 27.69,53.25 29.48,55.04 R25.1
BZZR
  Bottom 0.305: R7.2 30.53,34.24 30.53,41.45 27.76,44.22 27.76,45.52 24.42,48.85 U8.2
D
  pour Top: 0.4,82.55 arc-90 3.71,85.95 arc-90 7.57,82.58 arc-90 3.88,79.07 arc-90
  pour Top: 42.03,83.01 arc-90 45.56,86.49 arc-90 49.04,82.96 arc-90 45.54,79.5 arc-90
  pour Top: 0.45,3.76 arc-90 3.96,7.26 arc-90 7.46,3.73 arc-90 3.96,0.25 arc-90
  pour Top: 23.87,3.73 arc-90 27.4,7.21 arc-90 30.88,3.73 arc-90 27.35,0.2 arc-90
  pour Bottom: 49.04,83.01 arc90 45.51,86.49 arc90 42.03,83.01 arc90 45.62,79.5 arc90
  pour Bottom: 7.57,82.58 arc90 3.71,85.95 arc90 0.4,82.55 arc90 3.88,79.07 3.93,79.07 arc90
  pour Bottom: 7.46,3.73 arc90 3.93,7.26 arc90 0.45,3.76 arc90 4.04,0.25 arc90
  pour Bottom: 30.88,3.73 arc90 27.4,7.21 27.38,7.21 arc90 23.87,3.68 arc90 27.35,0.2 arc90
FN  (via drill 0.35)
  Top 0.305: R23.1 10.61,78.94 13.28,81.61 16.63,81.61 17.19,81.05 17.19,59.33 19.43,57.1 v19.43,56.59
  Bottom 0.305: v19.43,56.59 19.42,56.6 U8.25
GND  (via drill 0.38)  (8 unrouted)
  other vias: 21.82,70.94 21.1,69.34 18.39,60.55
  pour Bottom (rank 2): -3.13,89.2 -3.13,-4.17 52.22,-4.17 52.22,89.2
  pour Top (rank 2): -3.74,89.71 -3.74,-5.08 52.75,-5.08 52.75,89.71
HT
  pour Bottom: 8.91,41.25 8.91,33.88 10.41,32.39 13.54,32.39 15.16,34.01 15.16,41.12 13.76,42.52 10.18,42.52
HT2
  pour Bottom: 0.96,66.88 2.28,68.2 6.07,68.2 7.31,66.95 7.31,60.27 6.04,59 1.98,59 0.96,60.02
INT
  Bottom 0.305: U3.12 23.38,72.47 26.59,72.47 27.05,72.01 27.05,67.39 27.89,66.55 27.89,65.07 26.39,63.58 26.39,59.69 25.99,59.29 23.78,59.29 23.46,58.97 23.46,58.29 U8.33
M0  (via drill 0.38)
  Top 0.305: U5.M0 20.42,22.01 24.86,26.46 24.86,38.63 20.44,43.05 v20.44,51.44
  Bottom 0.305: U8.10 20.42,51.41 v20.44,51.44
M1  (via drill 0.38)
  Top 0.305: U5.M1 17.88,20.12 24.41,26.65 24.41,38.44 19.5,43.34 v19.5,51.08
  Bottom 0.305: U8.11 19.92,50.66 v19.5,51.08
MAIN
  Top 0.305: R2.1 39.95,49.93 MAIN.2
  Bottom 1.524: Q2.3 44.06,51.05 MAIN.2
MAIN_F
  Bottom 0.305: U8.39 27.73,55.75 29,57.02 35.02,57.02 35.61,56.44 35.61,54.16 R4.1
MAIN_S  (via drill 0.38)
  Top 0.305: R6.1 R2.2 33.52,53.47 v22.88,53.47
  Bottom 0.305: U8.18 22.6,53.75 v22.88,53.47
N$1
  Bottom 0.508: D2.1 11.35,44.3 C2.A 6.85,42.7 C3.1 6.86,40.97 U7.3
N$2
  Bottom 0.508: D3.1 8.63,55.14 C7.A 9.47,58.95 C8.1 9.06,61.84 U6.3
N$3
  Top 0.305: R1.1 13.48,74.04 U4.10
N$4
  Bottom 0.508: U7.2 5.87,36.5 C6.A 3.1,34.88 C4.1 3.09,33.96 F1.1
N$5
  Bottom 0.508: U6.2 10.51,64.29 C17.A 11.78,63.65 14.93,66.8 C9.1 13.81,69.22 F3.1
N$6
  Bottom 0.305: R30.2 37.44,59.26 R29.1 | R29.1 37.46,56.41 ESDA1.1 | R29.1 40.04,59.28 Q3.1
N$7
  Top 0.508: U5.ANT 42.32,16.07 44.73,13.67 X4.ANTENNA
N$8
  Bottom 0.305: SG1.+ 38.38,32.38 R7.1
N$9  (1 unrouted)
N$10  (1 unrouted)
  Top 0.305: U4.6 35.35,82.85
N$11
  Top 0.305: R21.1 37.29,85.6 D1.A
N$12  (1 unrouted)
N$13
  Bottom 0.305: R4.2 R20.1 | R20.1 39.68,50.67 Q2.1 | R20.1 ESDA.1
N$14
  Top 0.305: R17.1 13.56,7.29 16.51,7.29 D9.A
N$15  (1 unrouted)
N$16
  Top 0.305: R3.2 10.84,76.48 U4.8
N$17
  Top 0.305: D7.A 7.03,76.58 R3.1
N$18
  Bottom 0.305: U3.10 21.8,71.91 21.8,72.34 22.38,72.92 27.61,72.92 28.37,72.16 C16.2
N$19
  Top 0.305: J2.FEED R5.2 7.16,71.52 C32.2
N$20
  Top 0.305: R23.2 9.57,81.38 R24.2 10.41,82.85 U4.7
N$21
  Top 0.305: R26.1 14.78,5.34 D8.A
N$22
  Bottom 0.305: U3.20 22.31,67.4 23.54,66.17 C20.2
NRST
  Bottom 0.305: R11.2 17.06,47.65 C18.2 18.89,45.82 21.41,45.82 21.92,46.33 U8.7
OSC_IN
  Bottom 0.305: U8.5 22.92,44.81 C19.1 23.46,43.69 22.78,43 22.78,41.46 Y2.1
OSC_OUT
  Bottom 0.305: U8.6 22.42,45.54 C15.1 21.11,43.26 Y2.3
PIN22
  Bottom 0.305: U3.22 21.31,65.73 R9.1
RX1  (via drill 0.38)
  Top 0.305: U4.2 29.08,72.69 23.67,67.28 v23.67,55.47
  Bottom 0.305: v23.67,55.47 23.67,54.2 24.12,53.75 U8.43
RX2  (via drill 0.38)
  Top 0.305: v16.68,49.71 16.68,44.87 23.49,38.06 23.49,27.03 12.8,16.33 U5.TX
  Bottom 0.305: U8.13 17.39,51.25 16.61,50.47 16.61,49.78 v16.68,49.71
RX3  (via drill 0.38)
  Top 0.305: v19.89,55.75 20.57,55.08 20.57,54.51 40.15,34.93 45.28,34.93 X1.3
  Bottom 0.305: U8.22 v19.89,55.75
SCL  (via drill 0.38)
  Top 0.305: v20.88,62.71 20.88,60.07 v20.23,59.42
  Bottom 0.305: U2.4 20.64,62.01 20.24,62.41 20.24,66.75 20.81,67.32 U3.23 | U2.4 20.81,61.99 23.37,61.99 R19.1 | U2.4 20.79,62.62 v20.88,62.71 | U8.30 21.88,58.29 21.88,58.97 21.43,59.42 v20.23,59.42
SDA
  Bottom 0.305: U3.24 19.78,67.43 19.78,61.85 20.27,61.36 U2.3 21.87,61.36 R18.1 22.42,60.39 U8.31
SWCLK
  Bottom 0.305: U8.37 27.72,58.05 31.7,58.05 32.71,59.06 32.71,62.64 34.24,64.16 43.86,64.16 45.01,65.3 STM.2
SWDIO
  Bottom 0.305: U8.34 23.92,57.38 24.13,57.18 25.67,57.18 27.02,58.53 31.47,58.53 32.2,59.26 32.2,63.07 33.85,64.72 41.45,64.72 42.47,65.74 STM.3
TX1  (via drill 0.38)
  Top 0.305: R22.1 28.83,56.26 v24.37,56.26
  Bottom 0.305: v24.37,56.26 24.37,54.84 24.96,54.25 U8.42
TX2  (via drill 0.38)
  Top 0.305: U5.RX 15.34,18.23 23.95,26.84 23.95,38.25 18.64,43.56 v18.64,49.61
  Bottom 0.305: U8.12 19.28,49.61 v18.64,49.61
TX3  (via drill 0.38)
  Top 0.305: v19.33,54.99 40.61,33.71 X1.2
  Bottom 0.305: U8.21 19.07,55.25 v19.33,54.99
TXD
  Top 0.305: U4.1 32.69,67.64 R28.2 34.95,65.22 R22.2
V_BCKP  (1 unrouted)
  Top 0.305: U4.5 34.59,80.31 C27.2 36.57,80.6 C25.A 39.27,77.9 39.27,75.46 38.93,75.13 38.93,72.34 39.61,71.67 B2.+
VCC  (1 unrouted)
  Top 1.524: APOGEE.2 46.86,57.65 47.87,56.64 47.87,47.72 46.58,46.43 MAIN.1
  Bottom 0.508: D3.2 9.73,49.83 D2.2
  Bottom 0.762: SW1.1 5.18,49.83 D3.2
VDDA
  Bottom 0.305: L2.2 33.7,47.5 33.7,44.45 33.02,43.76 31.62,43.76 30.91,44.48 30.91,47.07 30.93,47.09 29.92,48.11 VDDA3.1 VDDA4.1 29.38,50.37 25.75,50.37 25.14,50.98 21.26,50.98 20.92,50.64 U8.9
XANT
  Top 0.305: U4.11 13.53,71.55 R5.1 10,71.48 C31.2

### Text on the board
tPlace: MERGEN / 09.03.2021